# Altium schematic sheet TKeyboard2_2021-07-30.schdoc
size 325 x 221 mm
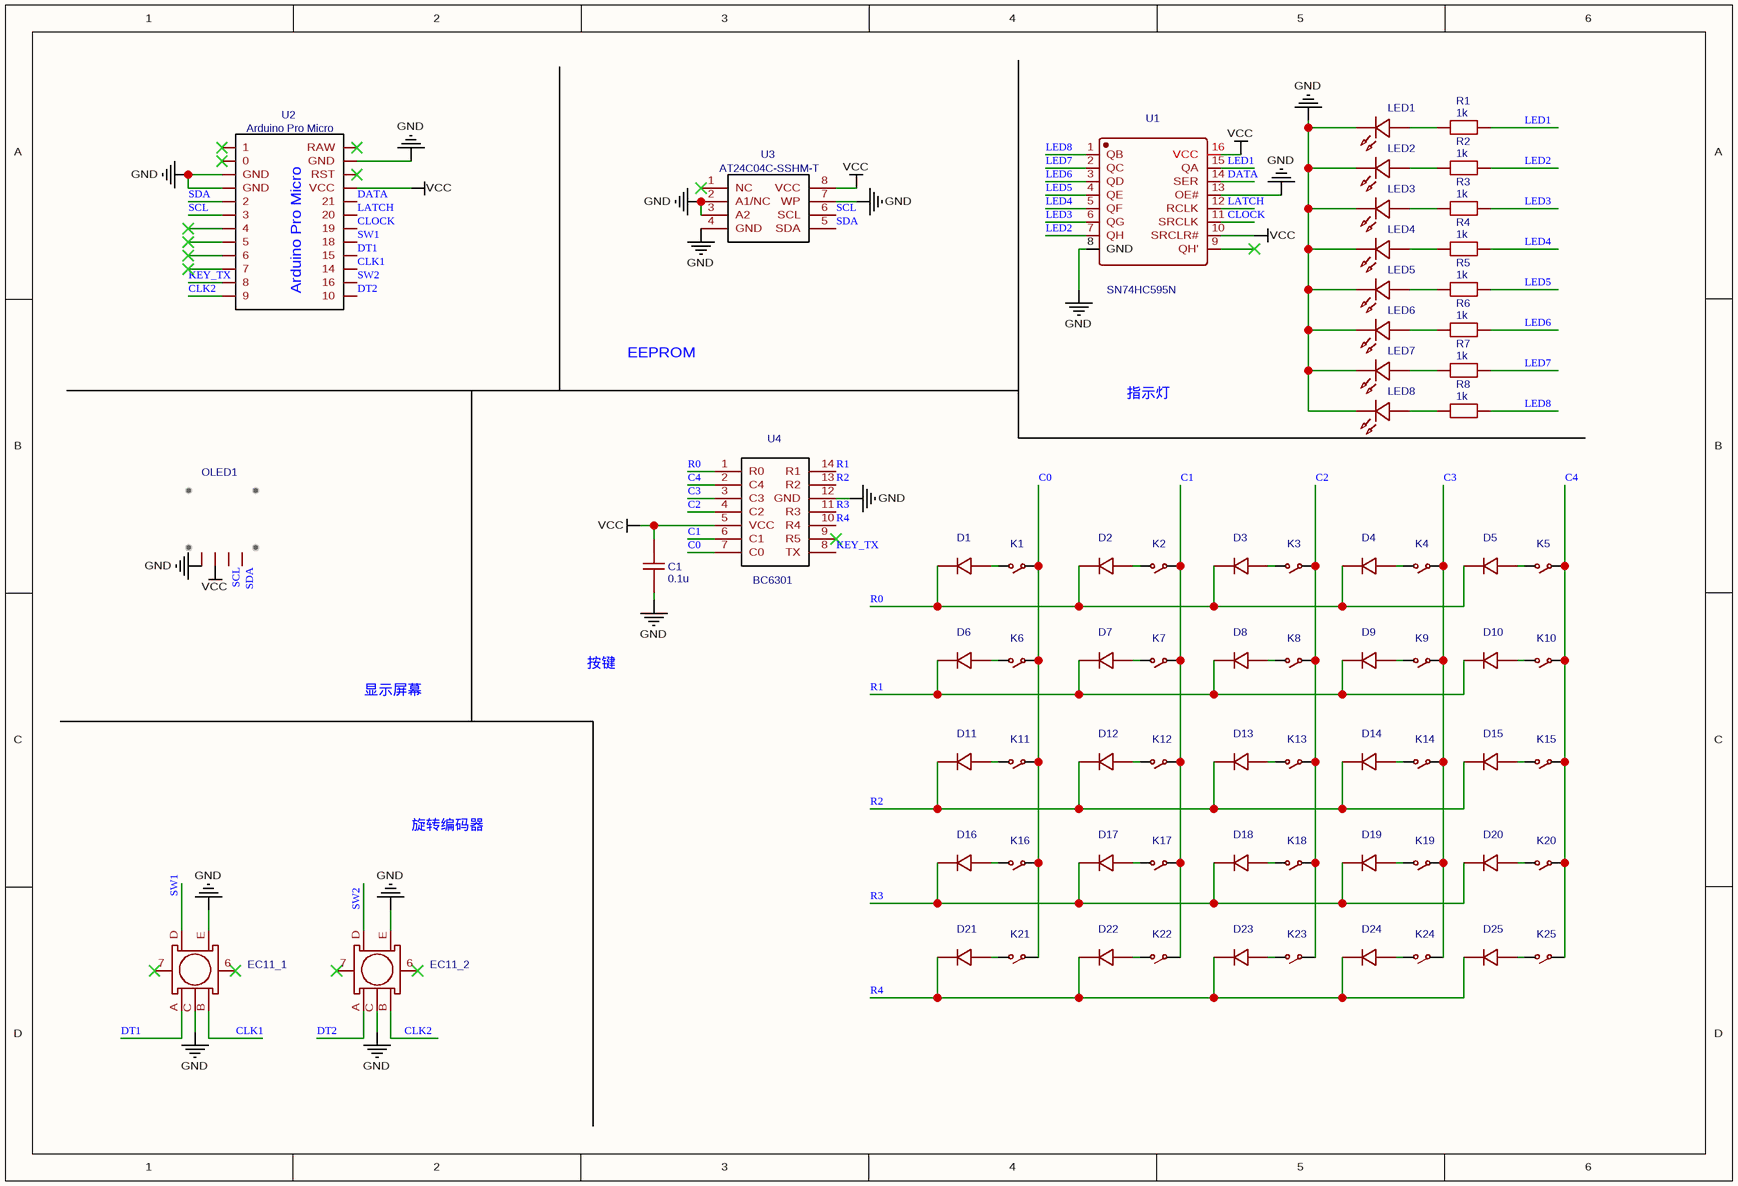
[diagram p0: TKeyboard2_2021-07-30.schdoc]

## Parts
C1  0.1u  [C0805]
D1  1N4148WS  [SOD-323_L1.8-W1.3-LS2.5-RD]  (value not drawn)
D2  1N4148WS  [SOD-323_L1.8-W1.3-LS2.5-RD]  (value not drawn)
D3  1N4148WS  [SOD-323_L1.8-W1.3-LS2.5-RD]  (value not drawn)
D4  1N4148WS  [SOD-323_L1.8-W1.3-LS2.5-RD]  (value not drawn)
D5  1N4148WS  [SOD-323_L1.8-W1.3-LS2.5-RD]  (value not drawn)
D6  1N4148WS  [SOD-323_L1.8-W1.3-LS2.5-RD]  (value not drawn)
D7  1N4148WS  [SOD-323_L1.8-W1.3-LS2.5-RD]  (value not drawn)
D8  1N4148WS  [SOD-323_L1.8-W1.3-LS2.5-RD]  (value not drawn)
D9  1N4148WS  [SOD-323_L1.8-W1.3-LS2.5-RD]  (value not drawn)
D10  1N4148WS  [SOD-323_L1.8-W1.3-LS2.5-RD]  (value not drawn)
D11  1N4148WS  [SOD-323_L1.8-W1.3-LS2.5-RD]  (value not drawn)
D12  1N4148WS  [SOD-323_L1.8-W1.3-LS2.5-RD]  (value not drawn)
D13  1N4148WS  [SOD-323_L1.8-W1.3-LS2.5-RD]  (value not drawn)
D14  1N4148WS  [SOD-323_L1.8-W1.3-LS2.5-RD]  (value not drawn)
D15  1N4148WS  [SOD-323_L1.8-W1.3-LS2.5-RD]  (value not drawn)
D16  1N4148WS  [SOD-323_L1.8-W1.3-LS2.5-RD]  (value not drawn)
D17  1N4148WS  [SOD-323_L1.8-W1.3-LS2.5-RD]  (value not drawn)
D18  1N4148WS  [SOD-323_L1.8-W1.3-LS2.5-RD]  (value not drawn)
D19  1N4148WS  [SOD-323_L1.8-W1.3-LS2.5-RD]  (value not drawn)
D20  1N4148WS  [SOD-323_L1.8-W1.3-LS2.5-RD]  (value not drawn)
D21  1N4148WS  [SOD-323_L1.8-W1.3-LS2.5-RD]  (value not drawn)
D22  1N4148WS  [SOD-323_L1.8-W1.3-LS2.5-RD]  (value not drawn)
D23  1N4148WS  [SOD-323_L1.8-W1.3-LS2.5-RD]  (value not drawn)
D24  1N4148WS  [SOD-323_L1.8-W1.3-LS2.5-RD]  (value not drawn)
D25  1N4148WS  [SOD-323_L1.8-W1.3-LS2.5-RD]  (value not drawn)
EC11_1  EC11E152T409  [SW-TH_EC11XXXXXXXX]  (value not drawn)
EC11_2  EC11E152T409  [SW-TH_EC11XXXXXXXX]  (value not drawn)
K1  CHERRY  [轴座_焊接热插拔_不带灯]  (value not drawn)
K2  CHERRY  [轴座_焊接热插拔_不带灯]  (value not drawn)
K3  CHERRY  [轴座_焊接热插拔_不带灯]  (value not drawn)
K4  CHERRY  [轴座_焊接热插拔_不带灯]  (value not drawn)
K5  CHERRY  [轴座_焊接热插拔_不带灯]  (value not drawn)
K6  CHERRY  [轴座_焊接热插拔_不带灯]  (value not drawn)
K7  CHERRY  [轴座_焊接热插拔_不带灯]  (value not drawn)
K8  CHERRY  [轴座_焊接热插拔_不带灯]  (value not drawn)
K9  CHERRY  [轴座_焊接热插拔_不带灯]  (value not drawn)
K10  CHERRY  [轴座_焊接热插拔_不带灯]  (value not drawn)
K11  CHERRY  [轴座_焊接热插拔_不带灯]  (value not drawn)
K12  CHERRY  [轴座_焊接热插拔_不带灯]  (value not drawn)
K13  CHERRY  [轴座_焊接热插拔_不带灯]  (value not drawn)
K14  CHERRY  [轴座_焊接热插拔_不带灯]  (value not drawn)
K15  CHERRY  [轴座_焊接热插拔_不带灯]  (value not drawn)
K16  CHERRY  [轴座_焊接热插拔_不带灯]  (value not drawn)
K17  CHERRY  [轴座_焊接热插拔_不带灯]  (value not drawn)
K18  CHERRY  [轴座_焊接热插拔_不带灯]  (value not drawn)
K19  CHERRY  [轴座_焊接热插拔_不带灯]  (value not drawn)
K20  CHERRY  [轴座_焊接热插拔_不带灯]  (value not drawn)
K21  CHERRY  [轴座_焊接热插拔_不带灯]  (value not drawn)
K22  CHERRY  [轴座_焊接热插拔_不带灯]  (value not drawn)
K23  CHERRY  [轴座_焊接热插拔_不带灯]  (value not drawn)
K24  CHERRY  [轴座_焊接热插拔_不带灯]  (value not drawn)
K25  CHERRY  [轴座_焊接热插拔_不带灯]  (value not drawn)
LED1  LED-0805_R  [LED0805_RED]  (value not drawn)
LED2  LED-0805_R  [LED0805_RED]  (value not drawn)
LED3  LED-0805_R  [LED0805_RED]  (value not drawn)
LED4  LED-0805_R  [LED0805_RED]  (value not drawn)
LED5  LED-0805_R  [LED0805_RED]  (value not drawn)
LED6  LED-0805_R  [LED0805_RED]  (value not drawn)
LED7  LED-0805_R  [LED0805_RED]  (value not drawn)
LED8  LED-0805_R  [LED0805_RED]  (value not drawn)
OLED1  0.96OLED_4P  [0.96OLED_4P]  (value not drawn)
R1  1k  [R0805]
R2  1k  [R0805]
R3  1k  [R0805]
R4  1k  [R0805]
R5  1k  [R0805]
R6  1k  [R0805]
R7  1k  [R0805]
R8  1k  [R0805]
U1  SN74HC595N  [SOP16]
U2  Arduino Pro Micro  [ARDUINO PRO MICRO_MINI]
U3  AT24C04C-SSHM-T  [SOP8]
U4  BC6301  [SOP-14_L8.6-W3.9-P1.27-LS6.0-TL]

## Nets
GND: C1.1 EC11_1.C EC11_1.E EC11_2.C EC11_2.E LED1.2 LED2.2 LED3.2 LED4.2 LED5.2 LED6.2 LED7.2 LED8.2 OLED1.1 U1.8(GND) U1.13(OE#) U2.3(GND) U2.4(GND) U2.23(GND) U3.2(A1/NC) U3.3(A2) U3.4(GND) U3.7(WP) U4.12(GND)
VCC: C1.2 OLED1.2 U1.10(SRCLR#) U1.16(VCC) U2.21(VCC) U3.8(VCC) U4.5(VCC)
C0: K1.1 K6.1 K11.1 K16.1 K21.1 U4.7(C0)
C1: K2.1 K7.1 K12.1 K17.1 K22.1 U4.6(C1)
C2: K3.1 K8.1 K13.1 K18.1 K23.1 U4.4(C2)
C3: K4.1 K9.1 K14.1 K19.1 K24.1 U4.3(C3)
C4: K5.1 K10.1 K15.1 K20.1 K25.1 U4.2(C4)
CLK1: EC11_1.B U2.15(14)
CLK2: EC11_2.B U2.12(9)
CLOCK: U1.11(SRCLK) U2.18(19)
DATA: U1.14(SER) U2.20(21)
DT1: EC11_1.A U2.16(15)
DT2: EC11_2.A U2.13(10)
KEY_TX: U2.11(8) U4.8(TX)
LATCH: U1.12(RCLK) U2.19(20)
LED1: R1.1 U1.15(QA)
LED2: R2.1 U1.7(QH)
LED3: R3.1 U1.6(QG)
LED4: R4.1 U1.5(QF)
LED5: R5.1 U1.4(QE)
LED6: R6.1 U1.3(QD)
LED7: R7.1 U1.2(QC)
LED8: R8.1 U1.1(QB)
R0: D1.1(K) D2.1(K) D3.1(K) D4.1(K) D5.1(K) U4.1(R0)
R1: D6.1(K) D7.1(K) D8.1(K) D9.1(K) D10.1(K) U4.14(R1)
R2: D11.1(K) D12.1(K) D13.1(K) D14.1(K) D15.1(K) U4.13(R2)
R3: D16.1(K) D17.1(K) D18.1(K) D19.1(K) D20.1(K) U4.11(R3)
R4: D21.1(K) D22.1(K) D23.1(K) D24.1(K) D25.1(K) U4.10(R4)
SCL: OLED1.3 U2.6(3) U3.6(SCL)
SDA: OLED1.4 U2.5(2) U3.5(SDA)
SW1: EC11_1.D U2.17(18)
SW2: EC11_2.D U2.14(16)
NetD1_2: D1.2(A) K1.2
NetD2_2: D2.2(A) K2.2
NetD3_2: D3.2(A) K3.2
NetD4_2: D4.2(A) K4.2
NetD5_2: D5.2(A) K5.2
NetD6_2: D6.2(A) K6.2
NetD7_2: D7.2(A) K7.2
NetD8_2: D8.2(A) K8.2
NetD9_2: D9.2(A) K9.2
NetD10_2: D10.2(A) K10.2
NetD11_2: D11.2(A) K11.2
NetD12_2: D12.2(A) K12.2
NetD13_2: D13.2(A) K13.2
NetD14_2: D14.2(A) K14.2
NetD15_2: D15.2(A) K15.2
NetD16_2: D16.2(A) K16.2
NetD17_2: D17.2(A) K17.2
NetD18_2: D18.2(A) K18.2
NetD19_2: D19.2(A) K19.2
NetD20_2: D20.2(A) K20.2
NetD21_2: D21.2(A) K21.2
NetD22_2: D22.2(A) K22.2
NetD23_2: D23.2(A) K23.2
NetD24_2: D24.2(A) K24.2
NetD25_2: D25.2(A) K25.2
NetLED1_1: LED1.1 R1.2
NetLED2_1: LED2.1 R2.2
NetLED3_1: LED3.1 R3.2
NetLED4_1: LED4.1 R4.2
NetLED5_1: LED5.1 R5.2
NetLED6_1: LED6.1 R6.2
NetLED7_1: LED7.1 R7.2
NetLED8_1: LED8.1 R8.2

Not connected (* = marked no-connect by the designer): EC11_1 6* 7*; EC11_2 6* 7*; U1 9(QH')*; U2 1* 2(0)* 7(4)* 8(5)* 9(6)* 10(7)* 22(RST)* 24(RAW)*; U3 1(NC)*; U4 9(R5)*

## Notes on the sheet
- EEPROM
- 指示灯
- 按键
- 显示屏幕
- 旋转编码器
- (in symbol 0.96OLED_4P) Hello World!!!

## Library data of the parts
C1 = 0.1u: nameAlias: Value(F); Contributor: LCEDA_Lib; spicePre: C; spiceSymbolName: C_0603_US
D1 = 1N4148WS: BOM_Manufacturer: HT; Contributor: LCSC; Package Display: No; BOM_Supplier: LCSC; BOM_Manufacturer Part: 1N4148WS; BOM_Supplier Part: C179718; BOM_JLCPCB Part Class: Extended Part; spicePre: D; spiceSymbolName: 1N4148WS
D2-D25 = 1N4148WS: BOM_Manufacturer: HT; Contributor: LCSC; BOM_Supplier: LCSC; BOM_Manufacturer Part: 1N4148WS; BOM_Supplier Part: C179718; BOM_JLCPCB Part Class: Extended Part; spicePre: D; spiceSymbolName: 1N4148WS
EC11_1 EC11_2 = EC11E152T409: BOM_Manufacturer: ALPS Electric; Contributor: LCSC; BOM_Supplier: LCSC; BOM_Supplier Part: C110314; BOM_Manufacturer Part: EC11E152T409; spicePre: S; spiceSymbolName: EC11E152T409
K1-K25 = CHERRY: Contributor: nicholasyoo; spicePre: U; spiceSymbolName: CHERRY
LED1-LED8 = LED-0805_R: BOM_Manufacturer: EVERLIGHT(台湾亿光); BOM_Manufacturer Part: 17-21SURC/S530-A3/TR8; Contributor: LCEDA_Lib; BOM_Supplier Part: C72037; spicePre: L; spiceSymbolName: LED-0805_R
OLED1 = 0.96OLED_4P: Contributor: LCEDA_Lib; BOM_Supplier: LCSC; spicePre: O; spiceSymbolName: 0.96OLED_4P
R1-R8 = 1k: nameAlias: Value(Ω); Contributor: LCEDA_Lib; spicePre: R; spiceSymbolName: R_0805_EU
U1 = SN74HC595N: BOM_Manufacturer: TI; BOM_Supplier: LCSC; BOM_Manufacturer Part: SN74HC595N; BOM_Supplier Part: C78711; BOM_JLCPCB Part Class: Extended Part; spicePre: U; spiceSymbolName: SN74HC595N
U2 = Arduino Pro Micro: Contributor: ruxia; spicePre: U; spiceSymbolName: Arduino Pro Micro
U3 = AT24C04C-SSHM-T: BOM_Manufacturer: MICROCHIP; BOM_Supplier: LCSC; BOM_Manufacturer Part: AT24C04C-SSHM-T; BOM_Supplier Part: C6205; BOM_JLCPCB Part Class: Extended Part; spicePre: U; spiceSymbolName: AT24C04C-SSHM-T
U4 = BC6301: Contributor: pc8051; spicePre: U; spiceSymbolName: BC6301